# EAGLE design Adafruit 1.2inch 8x8 backpack (EAGLE 9.6.2)
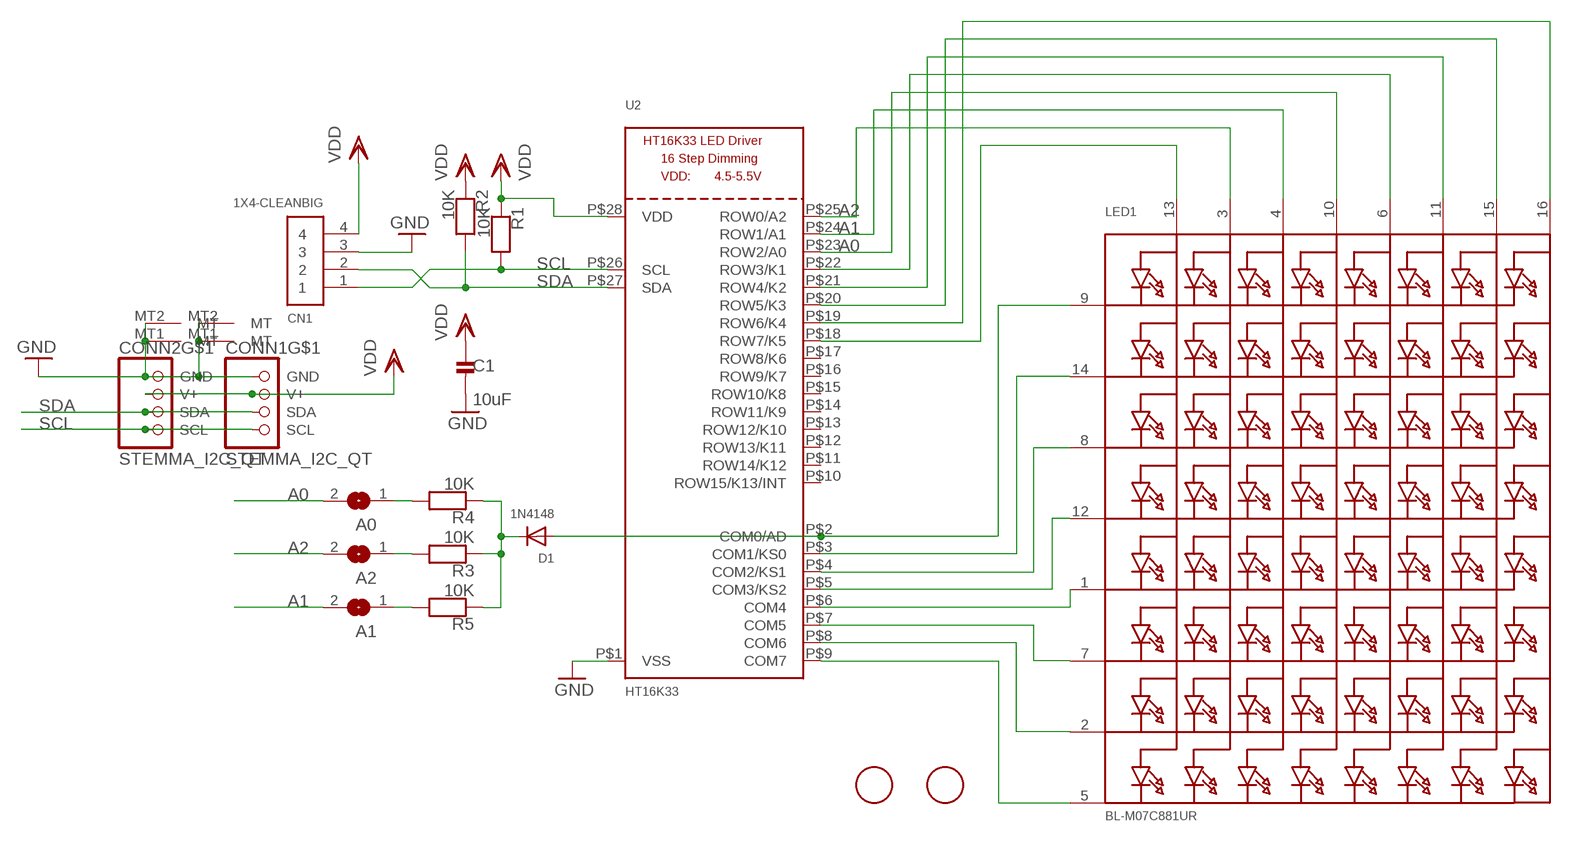
[diagram p0: schematic, sheet 1]

## Parts
A0  SOLDERJUMPERREFLOW_NOPASTE  [SOLDERJUMPER_REFLOW_NOPASTE]
A1  SOLDERJUMPERREFLOW_NOPASTE  [SOLDERJUMPER_REFLOW_NOPASTE]
A2  SOLDERJUMPERREFLOW_NOPASTE  [SOLDERJUMPER_REFLOW_NOPASTE]
C1  10uF  CAP_CERAMIC0805-NOOUTLINE  [0805-NO]
CN1  1X4-CLEANBIG  [1X04-CLEANBIG]
CONN1  STEMMA_I2C_QT  [JST_SH4]
CONN2  STEMMA_I2C_QT  [JST_SH4]
D1  1N4148  DIODESOD-323  [SOD-323]
LED1  BL-M07C881UR  DISP_SEGMENT_8X8_ROWCATHODEM12A881UR  [SEGMENT_BL-M12A881UR]
R1  10K  RESISTOR_0603_NOOUT  [0603-NO]
R2  10K  RESISTOR_0603_NOOUT  [0603-NO]
R3  10K  RESISTOR_0603_NOOUT  [0603-NO]
R4  10K  RESISTOR_0603_NOOUT  [0603-NO]
R5  10K  RESISTOR_0603_NOOUT  [0603-NO]
U2  HT16K33  HT16K33_SOP28  [SOP28_300MIL]
U$1  FIDUCIAL  [FIDUCIAL_1MM]
U$2  FIDUCIAL  [FIDUCIAL_1MM]

## Nets
A0: A0.2 LED1.10(A4) U2.P$23(ROW2/A0)
A1: A1.2 LED1.4(A3) U2.P$24(ROW1/A1)
A2: A2.2 LED1.3(A2) U2.P$25(ROW0/A2)
GND: C1.2 CN1.3 CONN1.1(GND) CONN1.MT1(MT) CONN1.MT2(MT) CONN2.1(GND) CONN2.MT1(MT) CONN2.MT2(MT) U2.P$1(VSS)
N$1: LED1.5(K8) U2.P$9(COM7)
N$2: LED1.2(K7) U2.P$8(COM6)
N$3: LED1.7(K6) U2.P$7(COM5)
N$4: LED1.1(K5) U2.P$6(COM4)
N$5: LED1.12(K4) U2.P$5(COM3/KS2)
N$6: LED1.8(K3) U2.P$4(COM2/KS1)
N$7: LED1.14(K2) U2.P$3(COM1/KS0)
N$8: D1.A LED1.9(K1) U2.P$2(COM0/AD)
N$10: A1.1 R5.2
N$12: LED1.6(A5) U2.P$22(ROW3/K1)
N$13: LED1.11(A6) U2.P$21(ROW4/K2)
N$14: D1.C R3.1 R4.1 R5.1
N$16: LED1.13(A1) U2.P$18(ROW7/K5)
N$19: A2.1 R3.2
N$20: A0.1 R4.2
SCL: CN1.1 CONN1.4(SCL) CONN2.4(SCL) R1.2 U2.P$26(SCL)
SDA: CN1.2 CONN1.3(SDA) CONN2.3(SDA) R2.2 U2.P$27(SDA)
SEG_F: LED1.15(A7) U2.P$20(ROW5/K3)
SEG_G: LED1.16(A8) U2.P$19(ROW6/K4)
VDD: C1.1 CN1.4 CONN1.2(V+) CONN2.2(V+) R1.1 R2.1 U2.P$28(VDD)
Unconnected: U2.P$10(ROW15/K13/INT) U2.P$11(ROW14/K12) U2.P$12(ROW13/K11) U2.P$13(ROW12/K10) U2.P$14(ROW11/K9) U2.P$15(ROW10/K8) U2.P$16(ROW9/K7) U2.P$17(ROW8/K6)

## Library data of the parts
A0 A1 A2 = microbuilder:SOLDERJUMPER: SMD Solder JUMPER Solder the two pads together to create a connection, or remove the solder to break it. REFLOW - Use this footprint for solder paste and reflow ovens. WAVE - Use this footprint for hand-soldering (larger pads). CLOSED - Has a trace between the two pads to ensure it is closed by default. The trace needs to be cut to disable the jumper, and can be closed again by creating a solder bridge between the two pads.
C1 = microbuilder:CAP_CERAMIC: Ceramic Capacitors For new designs, use the packages preceded by an '_' character since they are more reliable: The following footprints should be used on most boards: _0402 - Standard footprint for regular board layouts _0603 - Standard footprint for regular board layouts _0805 - Standard footprint for regular board layouts _1206 - Standard footprint for regular board layouts For extremely tight-pitch boards where space is at a premium, the following 'micro-pitch' footprints can be used (smaller pads, no silkscreen outline, etc.): _0402MP - Micro-pitch footprint for very dense/compact boards _0603MP - Micro-pitch footprint for very dense/compact boards _0805MP - Micro-pitch footprint for very dense/compact boards _1206MP - Micro-pitch footprint for very dense/compact boards
CN1 = adafruit:1X4: 4-pin connector
CONN1 CONN2 = adafruit_electromech:STEMMA_I2C; LCSC: C2845363
D1 = microbuilder:DIODE: Diode SMA Model Volts Amps Type Vf Ir Digikey # Notes SSA34-E3 40V 3A Schottky 480mV @ 3A 200uA @ 40V SSA34-E3/61TGITR-ND CDBA120-G 20V 1A Schottky 500mV @ 1A 500uA @ 20V 641-1014-6-ND REEL MBRA210 10V 2A Schottky 350mV @ 2A 700uA @ 10V MBRA210LT3 SOD-123 Model Volts Amps Type Vf Ir Order # Notes BAT54T1G 30V 200mA Schottky 800mV @ 200mA 2uA @ 25V BAT54T1GOSTR-ND B0530W 30V 500mA Schottky 430mV @ 500mA 130uA @ 30V B0530W-FDICT-ND REEL MBR120 20V 1A Schottky 340mV @ 1A MBR120VLSFT1GOSCT-ND SOD-323 Model Volts Amps Type Vf Ir Order # Notes PMEG2005EJ 20V 500mA Schottky 355mV @ 500mA 568-4110-1-ND ZLLS410 10V 570mA Schottky 380mV @ 570mA ZLLS410CT-ND 1N4148WS 75V 150mA Silicon/Simple 1V 1N4148WSFSCT-ND REEL SOD-523 Model Volts Amps Type Vf Ir Order # Notes BAT54XV2 30V 200mA Schottky 0.8V @ 100mA BAT54XV2CT-ND TB751S 30V 30mA Schottky RB751S-40TE61CT-ND SOT23-R/W (R = Solder Paste/Reflow Ovens, W = Hand-Soldering) Model Volts Amps Type Vf Ir Order # Notes BAT54FILM 40V 300mA Schottky 497-7162-1-ND POWERDI-5 Model Volts Amps Type Vf Ir Order # Notes PDS560 60V 5A Schottky 670mV @ 5A 150uA @ 60V PDS560DICT-ND
LED1 = adafruit_display:DISP_SEGMENT_8X8_ROWCATHODE: 8x8 LED Segment Displays: Row = Cathode 0.7" Red 8X8 Matrix, 1.9mm Round LEDs - BL-M07C881UR 1.2" Red 8x8 Matrix, 3.0mm Round LEDs - BL-M12A881UR 1.2" Red 8x8 Matrix, 3.0mm Square LEDs - BL-M12A883
R1-R5 = microbuilder:RESISTOR: Resistors For new designs, use the packages preceded by an '_' character since they are more reliable: The following footprints should be used on most boards: _0402 - Standard footprint for regular board layouts _0603 - Standard footprint for regular board layouts _0805 - Standard footprint for regular board layouts _1206 - Standard footprint for regular board layouts For extremely tight-pitch boards where space is at a premium, the following 'micro-pitch' footprints can be used (smaller pads, no silkscreen outline, etc.): _0402MP - Micro-pitch footprint for very dense/compact boards _0603MP - Micro-pitch footprint for very dense/compact boards _0805MP - Micro-pitch footprint for very dense/compact boards _1206MP - Micro-pitch footprint for very dense/compact boards
U2 = adafruit_display:HT16K33_SOP28
U$1 U$2 = adafruit:FIDUCIAL: For use by pick and place machines to calibrate the vision/machine, 1mm By microbuilder.eu

## Board
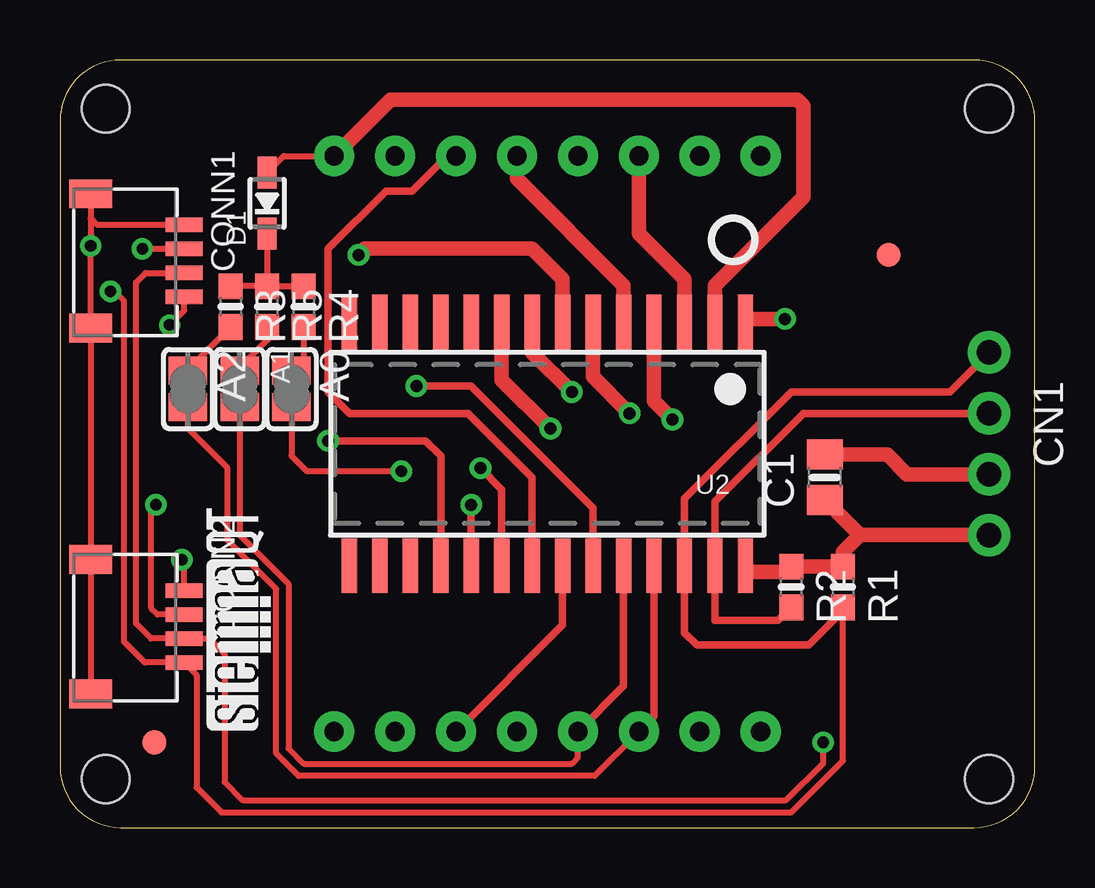
[diagram p1: board, top side]
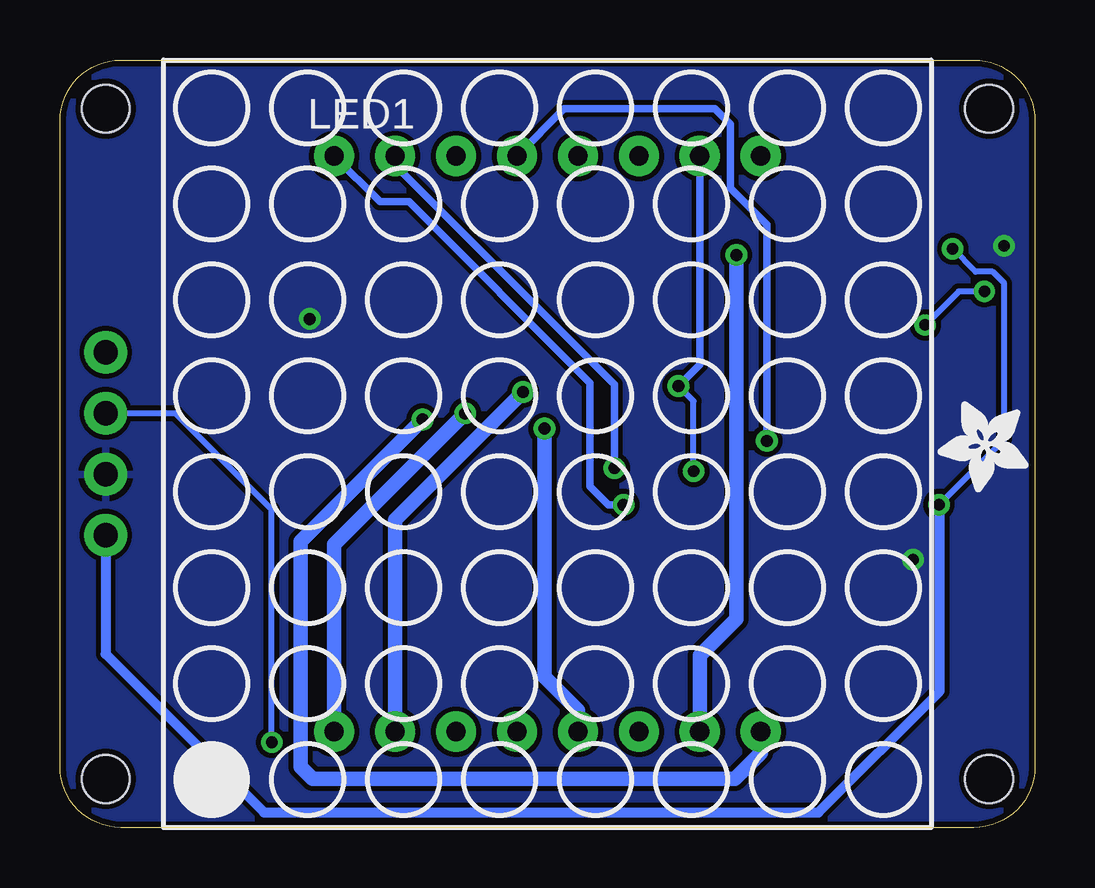
[diagram p2: board, bottom side, seen from below]

Size 40.64 x 32 mm. Coordinates in mm from the lower left corner, seen from the top.
Outline: 0,2.54 arc90 2.54,0 38.1,0 arc90 40.64,2.54 40.64,29.46 arc90 38.1,32 2.54,32 arc90 0,29.46 0,2.54
Copper layers (1*16): Top 0.035mm / dielectric 1.5mm / Bottom 0.035mm
Design rules "adafruit 8-8": minimum track width 6mil, minimum drill 15.5mil, track to track 8mil, track to pad 8mil, pad to pad 8mil, via to via 8mil, smd to smd 8mil, copper to edge 10mil, drill to drill 8mil, minimum pad ring 10mil, minimum via ring 8mil, stop-mask expansion 2mil, vias tented up to drill 20mil, thermal gap 10mil
Holes 2 mm at 1.91,29.97 1.91,2.03 38.73,29.97 38.73,2.03

### Footprints (pad centres in the part's own frame; a part is rotated, then mirrored left to right if it is on the bottom)
SOLDERJUMPER_REFLOW_NOPASTE = smd 1.168 x 1.6: 1 -0.762,0; 2 0.762,0
0805-NO = smd 1.24 x 1.5: 1 -0.95,0; 2 0.95,0
1X04-CLEANBIG = drill 1.016 pad 1.778: 1 -3.81,0; 2 -1.27,0; 3 1.27,0; 4 3.81,0
JST_SH4 = smd 0.6 x 1.55: 1 -1.5,2.006; 2 -0.5,2.006; 3 0.5,2.006; 4 1.5,2.006 | smd 1.2 x 1.8: MT1 -2.8,-1.894; MT2 2.8,-1.894
SOD-323 = smd 1.35 x 0.8: A 1.27,0; C -1.27,0
SEGMENT_BL-M12A881UR = drill 0.8 pad 1.676: 1 -8.89,-12; 2 -6.35,-12; 3 -3.81,-12; 4 -1.27,-12; 5 1.27,-12; 6 3.81,-12; 7 6.35,-12; 8 8.89,-12; 9 8.89,12; 10 6.35,12; 11 3.81,12; 12 1.27,12; 13 -1.27,12; 14 -3.81,12; 15 -6.35,12; 16 -8.89,12
0603-NO = smd 1.075 x 1: 1 -0.85,0; 2 0.85,0
SOP28_300MIL = smd 0.635 x 2.286: P$1 -8.255,-5.08; P$2 -6.985,-5.08; P$3 -5.715,-5.08; P$4 -4.445,-5.08; P$5 -3.175,-5.08; P$6 -1.905,-5.08; P$7 -0.635,-5.08; P$8 0.635,-5.08; P$9 1.905,-5.08; P$10 3.175,-5.08; P$11 4.445,-5.08; P$12 5.715,-5.08; P$13 6.985,-5.08; P$14 8.255,-5.08; P$15 8.255,5.08; P$16 6.985,5.08; P$17 5.715,5.08; P$18 4.445,5.08; P$19 3.175,5.08; P$20 1.905,5.08; P$21 0.635,5.08; P$22 -0.635,5.08; P$23 -1.905,5.08; P$24 -3.175,5.08; P$25 -4.445,5.08; P$26 -5.715,5.08; P$27 -6.985,5.08; P$28 -8.255,5.08
FIDUCIAL_1MM = smd 1 x 1: 1 0,0

### Placement (x,y rotation side)
A0  9.65,18.29 270 top
A1  7.49,18.29 270 top
A2  5.33,18.29 270 top
C1  31.88,14.6 90 top
CN1  38.73,16 270 top
CONN1  3.18,23.62 270 top
CONN2  3.18,8.38 270 top
D1  8.64,26.03 90 top
LED1  20.32,16 0 bottom
PLABEL0  [PLABEL0]  33.53,16.64 0 top
PLABEL1  [PLABEL1]  33.53,19.05 0 top
PLABEL2  [PLABEL2]  33.53,11.43 0 top
PLABEL3  [PLABEL3]  33.53,13.84 0 top
PLABEL4  [PLABEL4]  13.46,0.76 0 top
PLABEL5  [PLABEL5]  19.56,30.48 0 top
PLABEL6  [PLABEL6]  8.76,15.24 0 top
PLABEL7  [PLABEL7]  6.86,15.24 0 top
PLABEL8  [PLABEL8]  4.57,15.24 0 top
PLABEL9  [PLABEL9]  19.68,24.64 0 top
PLABEL10  [PLABEL10]  39.37,20.7 90 bottom
PLABEL11  [PLABEL11]  39.5,18.03 90 bottom
PLABEL12  [PLABEL12]  39.75,14.6 90 bottom
PLABEL13  [PLABEL13]  39.88,11.81 90 bottom
R1  32.64,10.03 270 top
R2  30.48,10.03 270 top
R3  7.11,21.72 270 top
R4  10.16,21.72 270 top
R5  8.64,21.72 270 top
U2  20.32,16 180 top
U$1  3.94,3.56 270 top
U$2  34.54,23.88 270 top
U$3  [ADAFRUIT_3.5MM]  0.25,17.78 180 bottom
U$4  [PCBFEAT-REV-040]  28.07,24.51 0 top
U$5  [STEMMAQT]  8.76,4.06 90 top

### Tracks (layer width: path | path; a pad name or v marks a point on that pad's centre or on a via)
A0  (via drill 0.48, 0.5)
  Top 0.254: A0.2 9.65,15.49 10.29,14.86 v14.22,14.86
  Top 0.305: v14.86,18.41 17.14,18.41 22.23,13.33 U2.P$23
  Bottom 0.254: v14.22,14.86 14.22,17.78 v14.86,18.41
  Bottom 0.305: LED1.10 13.97,19.3 v14.86,18.41
A1
  Top 0.254: LED1.4 21.59,2.92 21.34,2.67 10.16,2.67 9.53,3.3 9.53,10.16 7.49,12.19 A1.2
  Top 0.305: U2.P$24 23.5,5.91 LED1.4
A2
  Top 0.254: LED1.3 22.29,2.16 9.95,2.16 9.02,3.09 9.02,9.95 6.98,11.98 6.98,14.99 5.33,16.64 A2.2
  Top 0.305: U2.P$25 24.77,4.64 LED1.3
GND  (via drill 0.48, 0.5)
  Top 0.254: CONN1.MT1 1.28,25.4 | 1.28,25.4 v1.28,24.26 CONN1.MT2 CONN2.MT1 CONN2.MT2 | CONN1.1 1.56,25.12 1.28,25.4 | CONN2.1 5.18,11.07 v5.08,11.18
  Top 0.61: C1.2 34.48,15.55 35.31,14.73 CN1.3 | U2.P$1 28.7,21.21 v30.23,21.21
  pour Bottom: 40.89,32.38 0,32.38 0,-0.25 40.89,-0.25
N$1  (via drill 0.5)
  Top 0.61: U2.P$9 18.41,18.67 v20.45,16.64
  Bottom 0.61: v20.45,16.64 20.45,6.29 19.05,4.89 LED1.5
N$2  (via drill 0.5)
  Top 0.61: U2.P$8 19.68,19.81 v21.34,18.16
  Bottom 0.61: v21.34,18.16 26.67,12.83 LED1.2
N$3  (via drill 0.5)
  Top 0.61: U2.P$7 20.96,22.86 19.68,24.13 12.7,24.13 v12.45,23.88
  Bottom 0.61: v12.45,23.88 12.45,8.7 13.97,7.18 LED1.7
N$4  (via drill 0.5)
  Top 0.61: U2.P$6 22.23,18.8 v23.75,17.27
  Bottom 0.61: v23.75,17.27 29.21,11.81 LED1.1
N$5
  Top 0.61: U2.P$5 23.5,22.61 19.05,27.05 LED1.12
N$6  (via drill 0.5)
  Top 0.61: v25.53,17.02 24.77,17.78 U2.P$4
  Bottom 0.61: LED1.8 11.43,3.11 12.51,2.03 30.1,2.03 30.61,2.54 30.61,11.94 v25.53,17.02
N$7
  Top 0.61: LED1.14 24.13,24.77 26.04,22.86 U2.P$3
N$8
  Top 0.254: D1.A 9.33,28 LED1.9
  Top 0.61: U2.P$2 27.3,22.61 30.99,26.29 30.99,30.1 30.73,30.35 13.78,30.35 LED1.9
N$10
  Top 0.254: R5.2 8.64,20.32 7.49,19.18 A1.1
N$12
  Top 0.305: U2.P$22 20.96,8.45 LED1.6
N$13
  Top 0.305: LED1.11 16.13,28 14.67,26.54 13.59,26.54 11.18,24.13 11.18,18.16 12.06,17.27 17.02,17.27 19.68,14.6 U2.P$21
N$14
  Top 0.254: D1.C R5.1 | R5.1 R3.1 | R5.1 R4.1
N$16  (via drill 0.5)
  Top 0.305: U2.P$18 15.88,15.49 15.24,16.13 v11.18,16.13
  Bottom 0.305: LED1.13 19.62,29.97 13.34,29.97 12.7,29.34 12.7,26.67 11.18,25.15 v11.18,16.13
N$19
  Top 0.254: R3.2 5.33,19.09 A2.1
N$20
  Top 0.254: R4.2 10.16,19.56 A0.1
SCL  (via drill 0.48)
  Top 0.254: v2.11,22.35 2.29,22.35 2.67,21.97 2.67,7.75 3.53,6.88 CONN2.4 5.69,6.37 5.69,1.68 6.73,0.63 30.48,0.63 32.64,2.79 32.64,9.03 | v4.57,20.95 5.18,21.56 CONN1.4
  Top 0.305: CN1.1 37.08,18.16 30.48,18.16 26.04,13.72 U2.P$26 26.04,8.13 26.54,7.62 31.23,7.62 32.64,9.03 R1.2
  Bottom 0.254: v2.11,22.35 3.18,22.35 v4.57,20.95
SDA  (via drill 0.48)
  Top 0.254: CONN1.3 3.56,23.12 3.18,22.73 3.18,8.51 3.8,7.88 CONN2.3 6.21,7.88 6.86,7.24 6.86,1.9 7.62,1.14 30.27,1.14 31.81,2.69 v31.81,3.56
  Top 0.305: CN1.2 30.99,17.27 27.3,13.59 U2.P$27 27.3,8.64 29.93,8.64 R2.2
  Bottom 0.254: v31.81,3.56 31.81,13.27 35.81,17.27 CN1.2
SEG_F  (via drill 0.5)
  Top 0.305: U2.P$20 18.41,14.1 v17.53,14.99
  Bottom 0.305: v17.53,14.99 17.53,18.48 26.67,27.62 LED1.15
SEG_G  (via drill 0.5)
  Top 0.305: v17.14,13.46 U2.P$19
  Bottom 0.305: LED1.16 27.3,26.1 26.1,26.1 18.54,18.54 18.54,14.22 17.78,13.46 v17.14,13.46
VDD  (via drill 0.48)
  Top 0.254: CONN2.2 4.07,8.88 3.81,9.14 3.81,13.27 v4,13.46 | v3.43,24.13 CONN1.2
  Top 0.61: CN1.4 33.34,12.19 | 33.34,12.19 C1.1 | 33.34,12.19 32.64,11.49 R1.1 R2.1 30.27,10.67 28.83,10.67 U2.P$28
  Bottom 0.254: v3.43,24.13 2.48,23.18 1.77,23.18 1.28,22.69 1.28,16.18 3.97,13.49 v4,13.46
  Bottom 0.406: CN1.4 38.73,7.24 32.13,0.63 9.02,0.63 3.97,5.68 3.97,13.49

### Text on the board
Pinguin_tBackup: HT16K33 LED Backpack | Monochrome / 8x8 Matrix | SCL | SDA | A2 | A1 | A0 | GND | VCC | from adafruit!
Pinguin_bBackup: C | D | - | +